# Altium schematic sheet RELAY.SchDoc
size A4
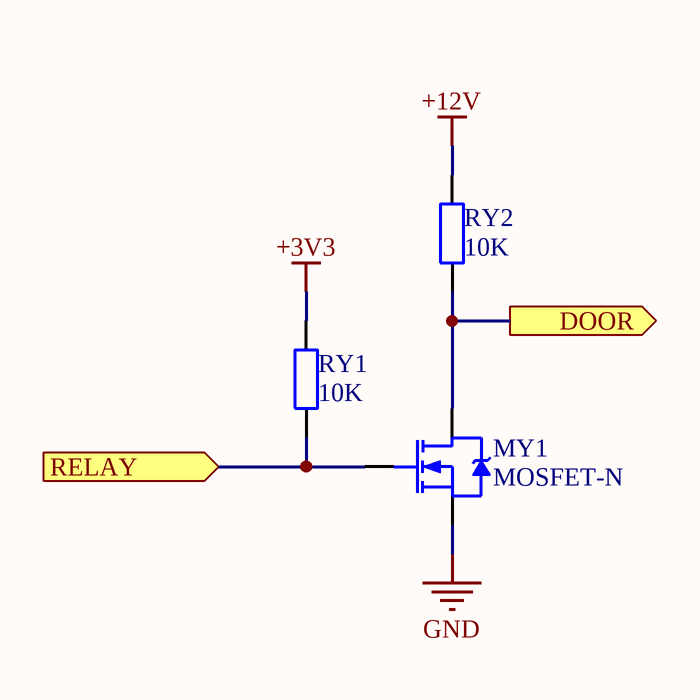
[diagram p0: RELAY.SchDoc]

## Parts
MY1  MOSFET-N  [SOT23_N]
RY1  value 10K  [RESC1608N]  (hidden comment: Res1)
RY2  value 10K  [RESC1608N]  (hidden comment: Res1)

## Ports
DOOR (out), RELAY (in)

## Nets
+3V3: RY1.2
+12V: RY2.2
GND: MY1.2(S)
DOOR: MY1.1(D) RY2.1 ; port DOOR
RELAY: MY1.3(G) RY1.1 ; port RELAY

## Library data of the parts
MY1 = SI2300
RY1 RY2 = Res1: Resistor; Published: 8-Jun-2000; LatestRevisionDate: 17-Jul-2002; LatestRevisionNote: Re-released for DXP Platform.; PackageReference: AXIAL-0.4; Publisher: Altium Limited